# Altium schematic sheet [01] - COVER PAGE.SchDoc: = ProjectName
size A3; Author: ABC; Organization: Altium Limited; Address1: L3, 12a Rodborough Rd; Address2: Frenchs Forest; Address3: NSW; Address4: Australia 2086; DocumentNumber: 1; SheetNumber: 1; SheetTotal: 1; PROJECT CODE: A_V1.0
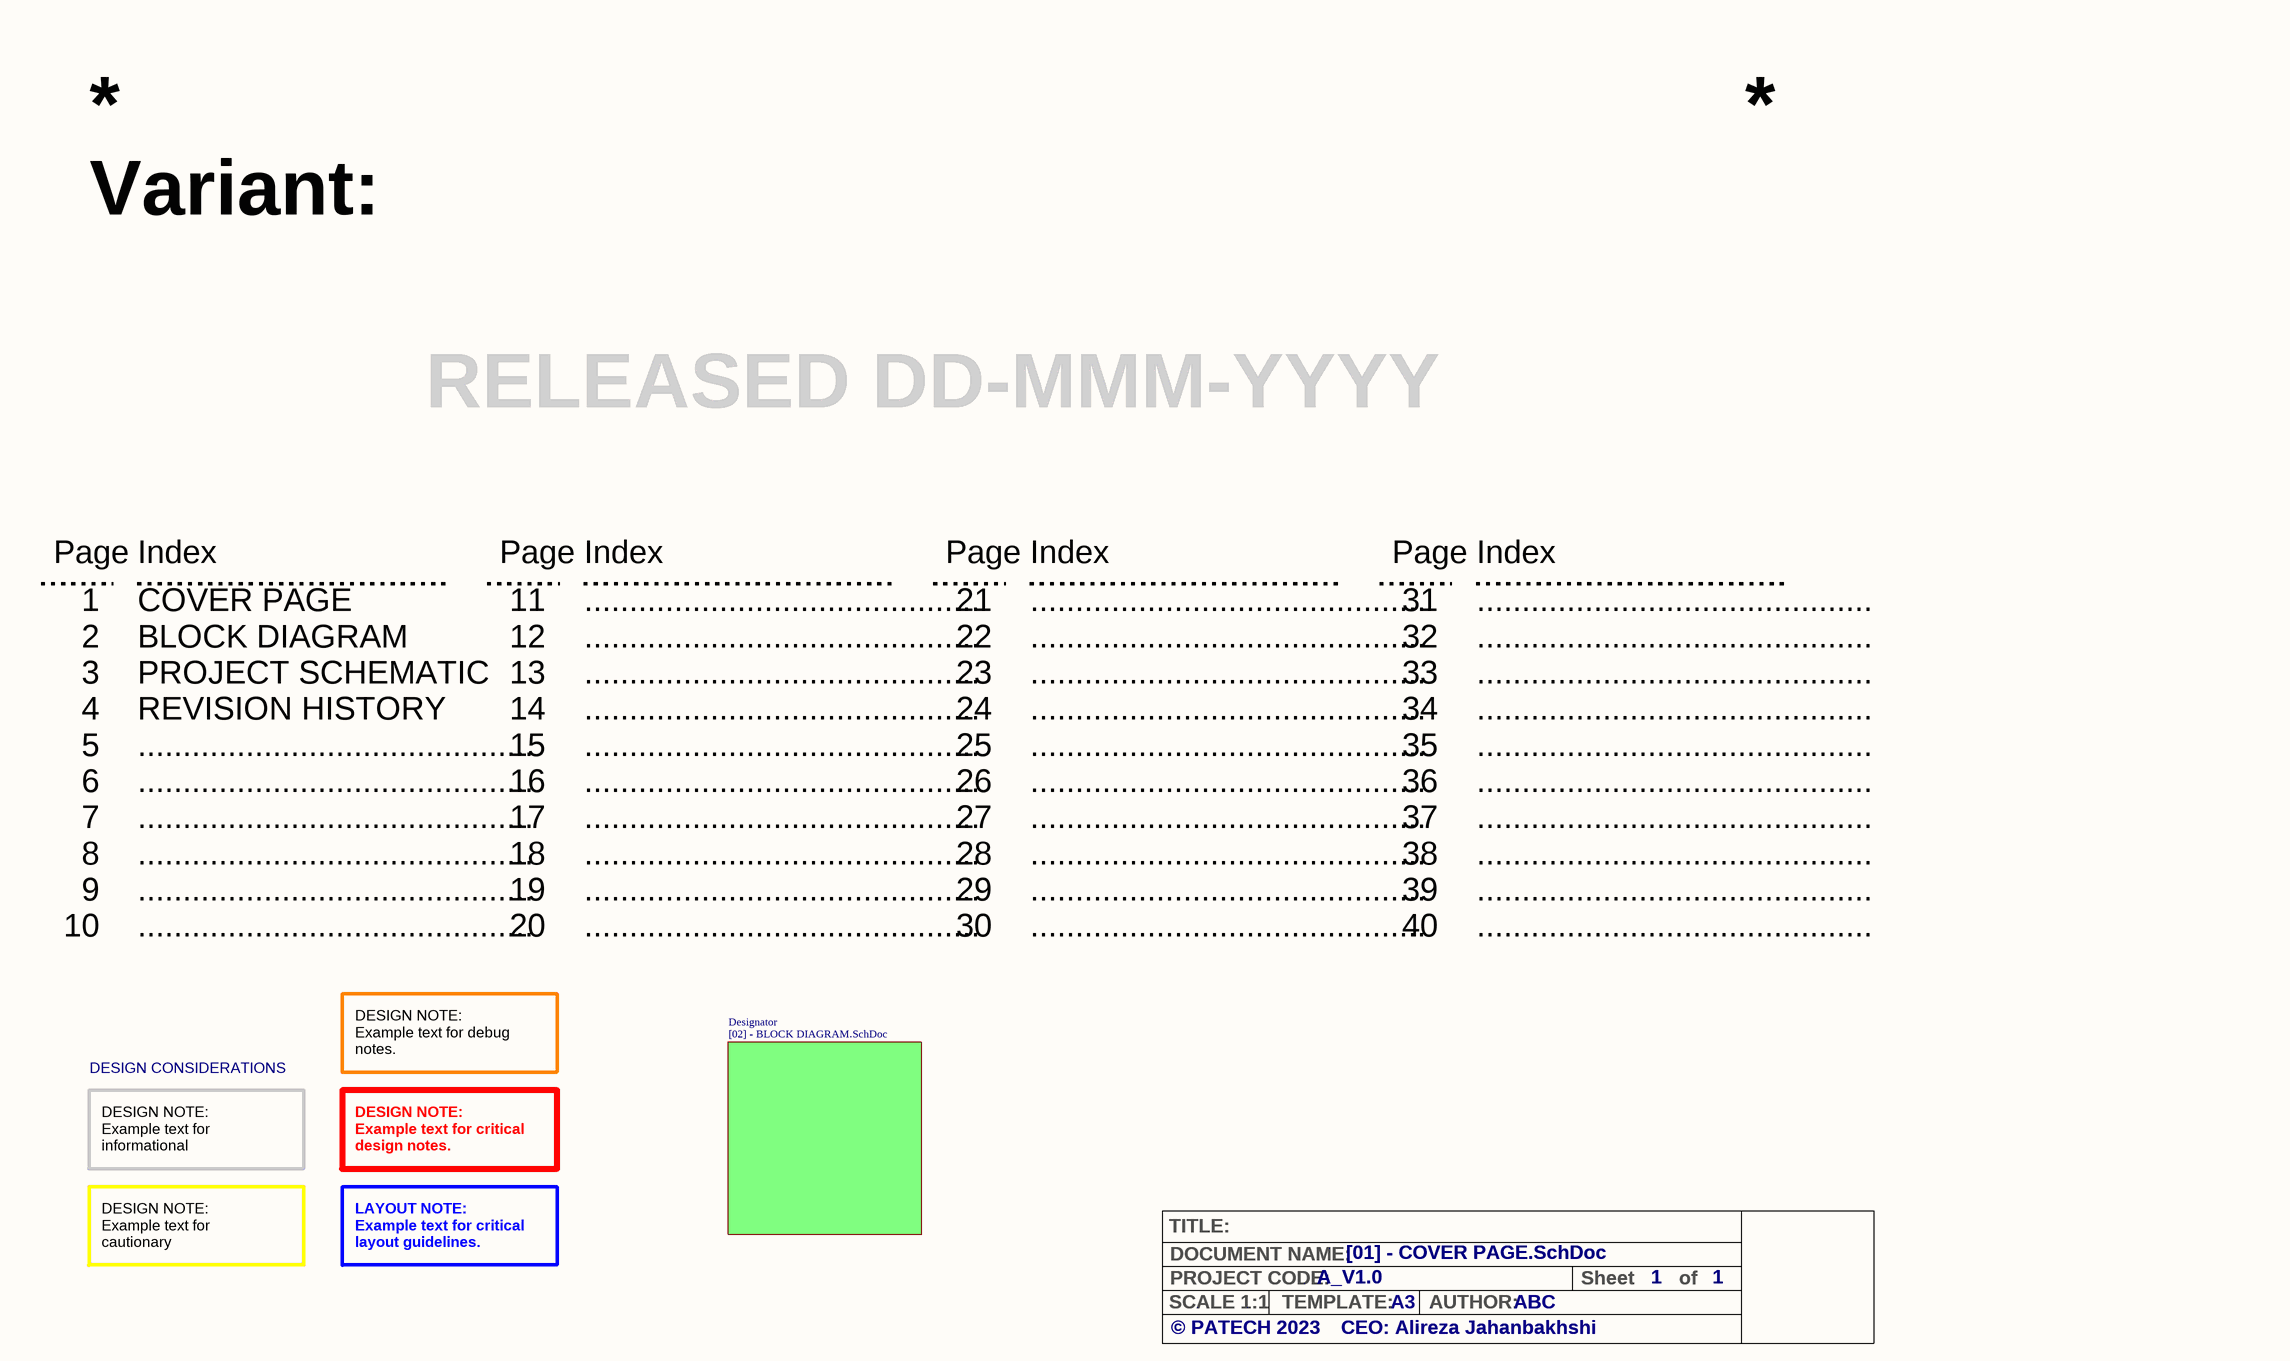
[diagram p0: [01] - COVER PAGE.SchDoc]

## Sub-sheets
Designator = [02] - BLOCK DIAGRAM.SchDoc: no entries

## Notes on the sheet
- Variant:
- RELEASED DD-MMM-YYYY
- Page
- Index
- 1
- COVER PAGE
- 11
- ............................................
- 21
- 31
- 2
- 3
- BLOCK DIAGRAM
- PROJECT SCHEMATIC
- 12
- 13
- 22
- 23
- 32
- 33
- 4
- 5
- REVISION HISTORY
- 14
- 15
- 24
- 25
- 34
- 35
- 6
- 16
- 26
- 36
- 7
- 8
- 17
- 18
- 27
- 28
- 37
- 38
- 9
- 10
- 19
- 20
- 29
- 30
- 39
- 40
- DESIGN NOTE:
  Example text for debug notes.
- DESIGN CONSIDERATIONS
- DESIGN NOTE:
  Example text for informational
  design notes.
- DESIGN NOTE:
  Example text for critical
  design notes.
- TITLE:
- DESIGN NOTE:
  Example text for cautionary
  design notes.
- LAYOUT NOTE:
  Example text for critical
  layout guidelines.
- DOCUMENT NAME:
- PROJECT CODE:
- Sheet
- of
- SCALE 1:1
- © PATECH 2023
- TEMPLATE:
- CEO: Alireza Jahanbakhshi
- AUTHOR:
- A3